# Altium schematic sheet DRAM and QSPI.SchDoc
size A4; SheetNumber: 3; SheetTotal: 8
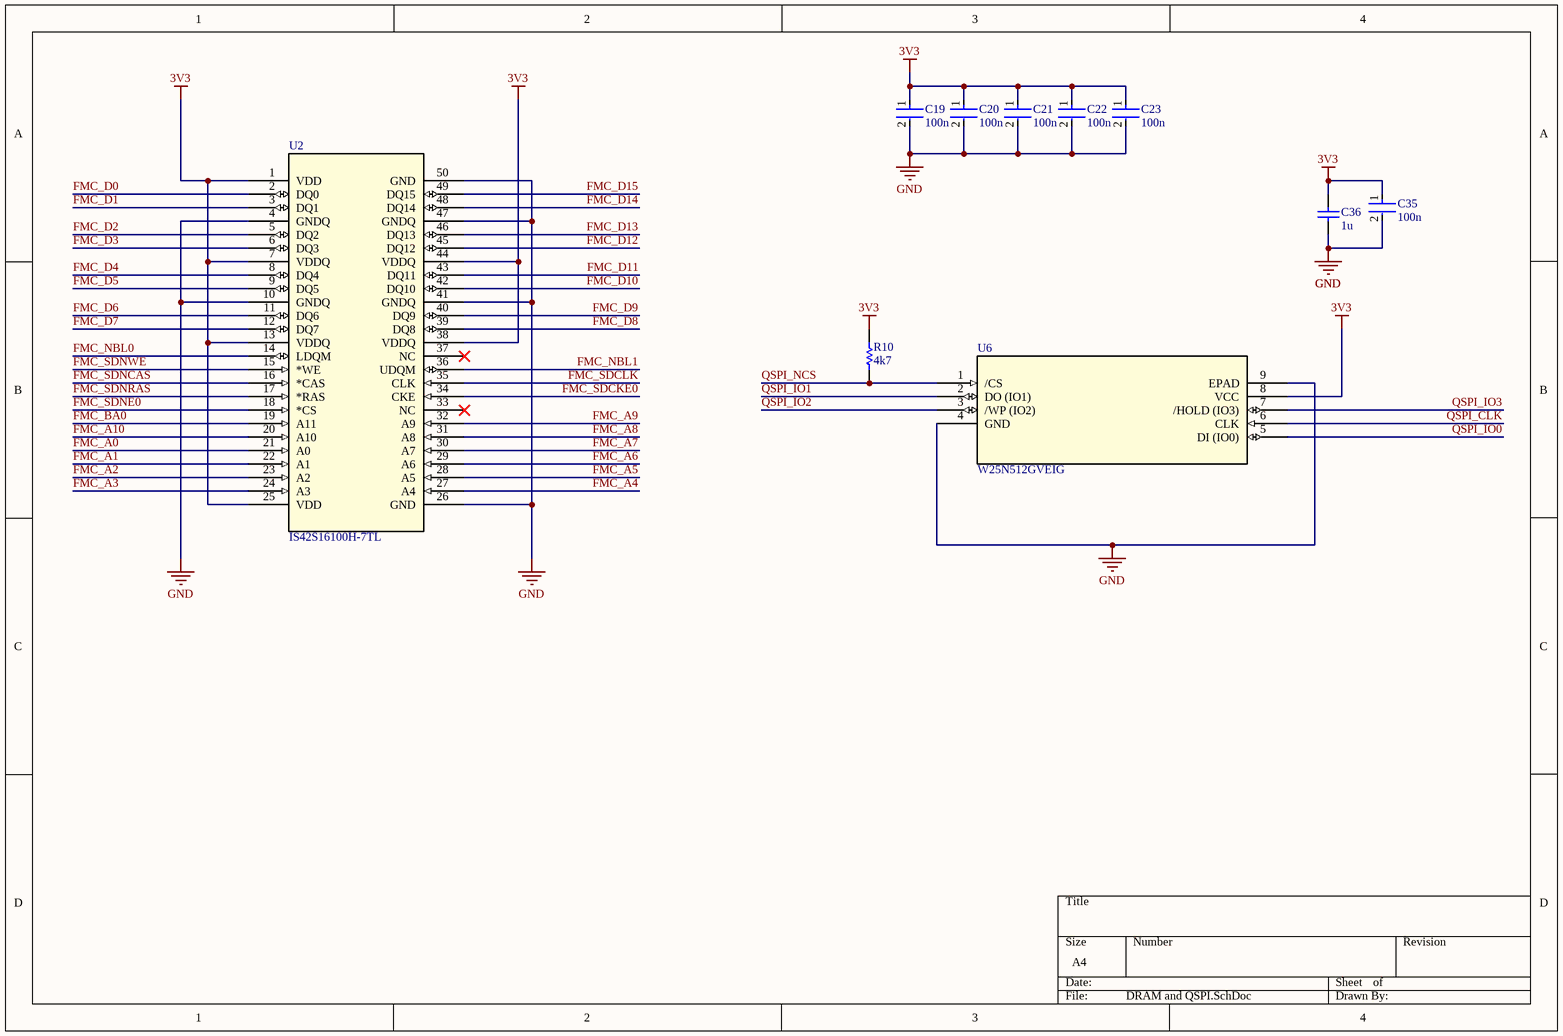
[diagram p0: DRAM and QSPI.SchDoc]

## Parts
C19  100n  [FP-GRM188-0_1-e0_2_0_55-IPC_A]
C20  100n  [FP-GRM188-0_1-e0_2_0_55-IPC_A]
C21  100n  [FP-GRM188-0_1-e0_2_0_55-IPC_A]
C22  100n  [FP-GRM188-0_1-e0_2_0_55-IPC_A]
C23  100n  [FP-GRM188-0_1-e0_2_0_55-IPC_A]
C35  100n  [FP-GRM188-0_1-e0_2_0_55-IPC_A]
C36  1u  [CAPC2013X135X45LL10T25]
R10  4k7  [RESC1608X55X30ML15T15]
U2  IS42S16100H-7TL  [TSOPII_50L_400MIL_ISI]
U6  W25N512GVEIG  [WSON8_8x6_E_WIN]

## Nets
3V3: C19.1 C20.1 C21.1 C22.1 C23.1 C35.1 C36.2 R10.2 U2.1(VDD) U2.7(VDDQ) U2.13(VDDQ) U2.25(VDD) U2.38(VDDQ) U2.44(VDDQ) U6.8(VCC)
GND: C19.2 C20.2 C21.2 C22.2 C23.2 C35.2 C36.1 U2.4(GNDQ) U2.10(GNDQ) U2.26(GND) U2.41(GNDQ) U2.47(GNDQ) U2.50(GND) U6.4(GND) U6.9(EPAD)
FMC_A0: U2.21(A0)
FMC_A1: U2.22(A1)
FMC_A2: U2.23(A2)
FMC_A3: U2.24(A3)
FMC_A4: U2.27(A4)
FMC_A5: U2.28(A5)
FMC_A6: U2.29(A6)
FMC_A7: U2.30(A7)
FMC_A8: U2.31(A8)
FMC_A9: U2.32(A9)
FMC_A10: U2.20(A10)
FMC_BA0: U2.19(A11)
FMC_D0: U2.2(DQ0)
FMC_D1: U2.3(DQ1)
FMC_D2: U2.5(DQ2)
FMC_D3: U2.6(DQ3)
FMC_D4: U2.8(DQ4)
FMC_D5: U2.9(DQ5)
FMC_D6: U2.11(DQ6)
FMC_D7: U2.12(DQ7)
FMC_D8: U2.39(DQ8)
FMC_D9: U2.40(DQ9)
FMC_D10: U2.42(DQ10)
FMC_D11: U2.43(DQ11)
FMC_D12: U2.45(DQ12)
FMC_D13: U2.46(DQ13)
FMC_D14: U2.48(DQ14)
FMC_D15: U2.49(DQ15)
FMC_NBL0: U2.14(LDQM)
FMC_NBL1: U2.36(UDQM)
FMC_SDCKE0: U2.34(CKE)
FMC_SDCLK: U2.35(CLK)
FMC_SDNCAS: U2.16(*CAS)
FMC_SDNE0: U2.18(*CS)
FMC_SDNRAS: U2.17(*RAS)
FMC_SDNWE: U2.15(*WE)
QSPI_CLK: U6.6(CLK)
QSPI_IO0: U6.5(DI_(IO0))
QSPI_IO1: U6.2(DO_(IO1))
QSPI_IO2: U6.3(/WP_(IO2))
QSPI_IO3: U6.7(/HOLD_(IO3))
QSPI_NCS: R10.1 U6.1(/CS)

Not connected (* = marked no-connect by the designer): U2 33(NC)* 37(NC)*

## Library data of the parts
C19-C23 C35 = CMP-2006-02792-2: Chip Multilayer Ceramic Capacitors for General Purpose, 0603, 10uF, X5R, 15%, 20%, 6.3V; Packaging: Tape and Reel; Voltage Rating (DC): 6.3V; Width: 0.031inch; Termination: SMD/SMT; Dielectric: X5R; Package Quantity: 4000; Voltage Rating: 6.3V; Capacitance: 10uF; Case/Package: 0603; Min Operating Temperature: -55°C; Voltage: 6.3V; Length: 1.6mm; Thickness: 0.035inch; Lead Free: Lead Free; Depth: 0.8mm; Case Code (Imperial): 0603; Max Operating Temperature: 85°C; Material: Ceramic; Height: 0.8mm; Tolerance: 20%; Mount: Surface Mount; REACH SVHC: No SVHC; Radiation Hardening: No; Case Code (Metric): 1608
C36 = CMP-1662-00015-2: Chip Capacitor, 4.7 uF, +/- 10%, 16 V, -55 to 85 degC, 0805 (2012 Metric), RoHS, Tape and Reel; PartNumber: GRM21BR61C475KA88L; Voltage Rating (DC): 16 V; Capacitance: 4.7 uF; Type (Capacitors): X5R; Case\/Package: 0805; Pins: 2; DatasheetVersion: 03/2016; REACH SVHC: No SVHC; Tolerance: 10%; Width: 1.25 mm; Mount: Surface Mount; ComponentLink1Description: Manufacturer URL; Case Code (Metric): 2012; PackageDescription: 2-Pin Surface Mount Device, Body 2 x 1.25 mm; Height: 1.25 mm; Voltage Rating: 16 V; Max Operating Temperature: 85 degC; RoHSCompliant: true; Length: 2 mm; ComponentLink1URL: http://www.murata.com/; Mounting Technology: Surface Mount; Packaging: Tape and Reel; Min Operating Temperature: -55 degC; ComponentLink2Description: Datasheet; Case Code (Imperial): 0805; Radiation Hardening: No; Package Quantity: 3000; PackageReference: 0805; ComponentLink2URL: http://search.murata.co.jp/Ceramy/image/img/A01X/G101/ENG/GRM21BR61C475KA88-01.pdf
R10 = CMP-2000-00182-1: Part Number: ERJ-3EKF1003V; Manufacturer: Panasonic
U2 = IS42S16100H-7TL: No Description Available; Mfr_Name: ISSI; RefDes: RefDes; Type: Type
U6 = W25N512GVEIG: No Description Available; Mfr_Name: Winbond; Type: Memory; RefDes: RefDes